# Altium schematic sheet CutMonitor.SchDoc
size 594 x 420 mm; DocumentNumber: ФНКЦ.452312.001 Э3; SheetNumber: 2; Format: A2
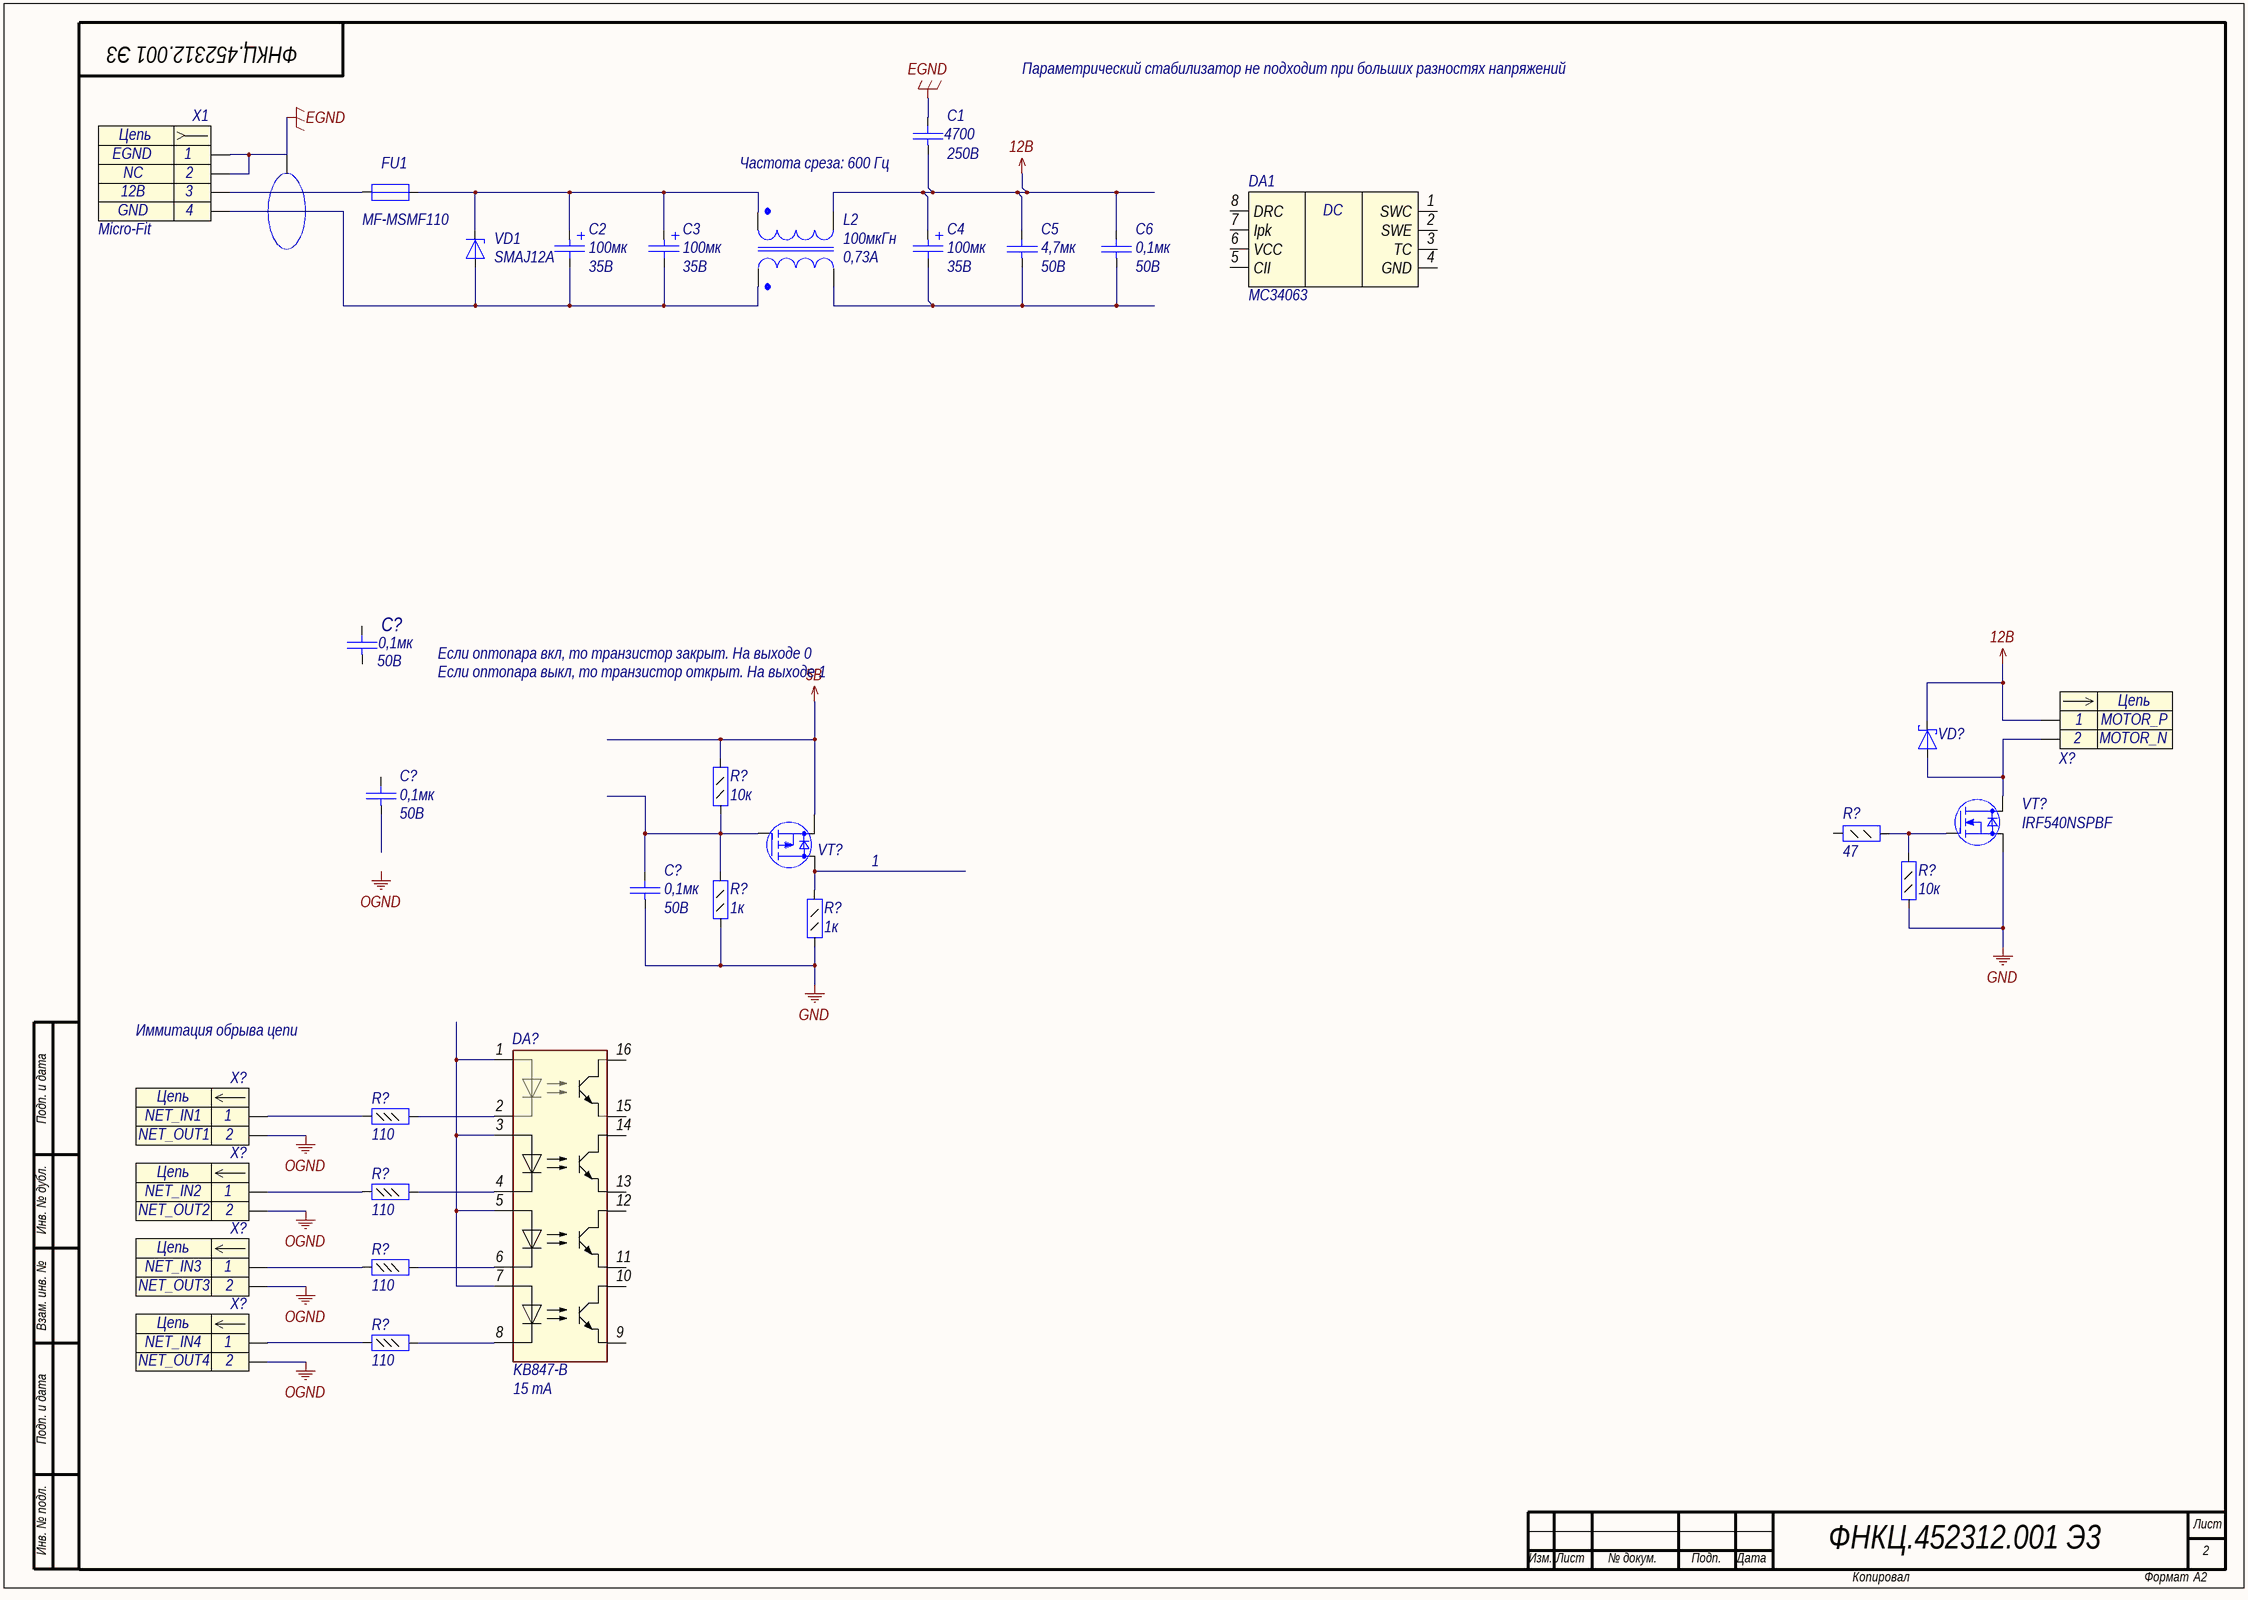
[diagram p0: CutMonitor.SchDoc]

## Parts
(Parts that share a designator on the sheet are numbered #1, #2 ... from top to bottom, then left to right.)
C1  value 4700  Voltage: 250В  [C0805]  (hidden comment: Capacitor)
C2  value 100мк  Voltage: 35В  [K50-35(6.3X11)]  (hidden comment: Capacitor_pol)
C3  value 100мк  Voltage: 35В  [K50-35(6.3X11)]  (hidden comment: Capacitor_pol)
C4  value 100мк  Voltage: 35В  [K50-35(6.3X11)]  (hidden comment: Capacitor_pol)
C5  value 4,7мк  Voltage: 50В  [C0805]  (hidden comment: Capacitor)
C6  value 0,1мк  Voltage: 50B  [C0603]  (hidden comment: Capacitor)
C?#1  value 0,1мк  Voltage: 50B  [C0603]  (hidden comment: Capacitor)
C?#2  value 0,1мк  Voltage: 50B  [C0805]  (hidden comment: Capacitor)
C?#3  value 0,1мк  Voltage: 50B  [C0805]  (hidden comment: Capacitor)
DA1  MC34063  [SO8]
DA?  Part Number: KB847-B  [OPTO-16]  (hidden comment: OPTO-4)
FU1  Part Number: MF-MSMF110  [FUSE812]  (hidden comment: Fuse)
L2  value 100мкГн  Rated Current: 0,73A  [SRF0703]  (hidden comment: Dual-Winding Inductor)
R?#1  value 10к  [R0805]  (hidden comment: Resistor_0,125Вт)
R?#2  value 47  [R0805]  (hidden comment: Resistor_0,125Вт)
R?#3  value 10к  [R0805]  (hidden comment: Resistor_0,125Вт)
R?#4  value 1к  [R0805]  (hidden comment: Resistor_0,125Вт)
R?#5  value 1к  [R0805]  (hidden comment: Resistor_0,125Вт)
R?#6  value 110  [R0603]  (hidden comment: Resistor_0,062Вт)
R?#7  value 110  [R0603]  (hidden comment: Resistor_0,062Вт)
R?#8  value 110  [R0603]  (hidden comment: Resistor_0,062Вт)
R?#9  value 110  [R0603]  (hidden comment: Resistor_0,062Вт)
VD1  Part Number: SMAJ12A  [SMA]  (hidden comment: DiodeZener)
VD?  DiodeSchottky  [SMA]  (value not drawn)
VT?#1  P-MOSFET  [SOT23-3]  (value not drawn)
VT?#2  Part Number: IRF540NSPBF  [D2PAK]  (hidden comment: N-MOSFET)
X1  Micro-Fit  [43045-0400]
X?#1  (no value)  [JUMPER_2.54]
X?#2  (no value)  [JUMPER_2.54]
X?#3  (no value)  [JUMPER_2.54]
X?#4  (no value)  [JUMPER_2.54]
X?#5  (no value)  [JUMPER_2.54]

## Nets
5В: R?#1.2 VT?#1.3(S)
12B: C1.1 C4.1 C5.2 C6.2 L2.4 VD?.1(K) X?#1.1
EGND: C1.2 X1.1 X1.2
GND: C?#3.1 R?#3.1 R?#4.1 R?#5.1 VT?#2.3(S)
OGND: X?#2.2 X?#3.2 X?#4.2 X?#5.2
NetC2_1: C2.1 C3.1 FU1.2 L2.2 VD1.1(K)
NetC2_2: C2.2 C3.2 L2.1 VD1.2(A) X1.4
NetC4_2: C4.2 C5.1 C6.1 L2.3
NetC?#3_2: C?#3.2 R?#1.1 R?#4.2 VT?#1.1(G)
NetDA?_1: DA?.1 DA?.3 DA?.5 DA?.7
NetDA?_2: DA?.2 R?#6.2
NetDA?_4: DA?.4 R?#7.2
NetDA?_6: DA?.6 R?#8.2
NetDA?_8: DA?.8 R?#9.2
NetFU1_1: FU1.1 X1.3
NetR?#2_2: R?#2.2 R?#3.2 VT?#2.1(G)
NetR?#5_2: R?#5.2 VT?#1.2(D)
NetR?#6_1: R?#6.1 X?#2.1
NetR?#7_1: R?#7.1 X?#3.1
NetR?#8_1: R?#8.1 X?#4.1
NetR?#9_1: R?#9.1 X?#5.1
NetVD?_2: VD?.2(A) VT?#2.2(D) X?#1.2

Not connected (* = marked no-connect by the designer): C?#1 1 2; C?#2 1 2; DA1 1(SWC) 2(SWE) 3(TC) 4(GND) 5(CII) 6(VCC) 7(Ipk) 8(DRC); DA? 9 10 11 12 13 14 15 16; R?#2 1

## Notes on the sheet
- Параметрический стабилизатор не подходит при больших разностях напряжений
- (near C1) Частота среза: 600 Гц
- Если оптопара вкл, то транзистор закрыт. На выходе 0
- Если оптопара выкл, то транзистор открыт. На выходе 1
- 1
- Иммитация обрыва цепи
- Подп. и дата
- Инв. № дубл.
- Взам. инв. №
- (near DA?) 15 mA
- Инв. № подл.
- Лист
- Изм.
- № докум.
- Подп.
- Дата
- Копировал
- Формат
- Labels drawn without touching a wire or pin: OGND
- (in symbol connect51) Цепь
- (in symbol connect54) Цепь
- (in symbol pwr21) DC

## Library data of the parts
C1 = cap170: Конденсатор; Part Name: Ceramic; Manufacture: Murata; Part Number: GRM21AR72E472KW; id: cap170; TKE: X7R
C2-C4 = cap226: Конденсатор полярный; Part Name: Electrolit; Manufacture: Jamicon; Part Number: TKR101M1VE11; id: cap226; tga: 0,20%
C5 = cap223: Конденсатор; Part Name: Ceramic; Manufacture: Murata; Part Number: GRM21BZ71H475KE15L; id: cap223; TKE: X7R
C6 C?#1 = cap131: Конденсатор; Part Name: Ceramic; Manufacture: Murata; Part Number: GRM188R71H104KA93D; id: cap131; TKE: X7R
C?#2 C?#3 = cap141: Конденсатор; Part Name: Ceramic; Manufacture: Murata; Part Number: GRM21BR71H104K**; id: cap141; TKE: X7R
DA1 = pwr21: 1.5 A, Step-Up/Down/  Inverting Switching  Regulators; Part Number: MC34063ADR2G; Manufacturer: ON Semiconductor; id: pwr21; Input Voltage: 3-40B; Output Voltage: Adj; Current: 1,5A; Part Name: 1.5 A, Step-Up/Down/ Inverting Switching Regulators; Type: Impulse
DA? = KB847-B: Опторазвязка х4; Manufacturer: Kingbright; id: opto1; Cut-off frequency: 80kHz; Forward Voltage: 1,2B
FU1 = fuse9: Предохранитель; Part Name: Resettable Fuses; Manufacture: Bourns; id: fuse9; V max: 6B; I max: 100A; I hold: 1,1A; I trip: 2,2A; Resistance: 0,04Ohms
L2 = ind24: Синфазный дроссель; Part Name: Dual-Winding Shielded Power Inductors; Part Number: SRF0703-101M; Manufacture: Bourns; id: ind24; Saturation Current: 0,79A; Resistance: 0,715Ohm
R?#1 R?#3 = res97: Резистор; Manufacture: Yageo; Part Number: RC0805FR-0710KL; id: res97; Accuracy: 0,01; Part Name: Resistor; Power: 0,125Вт
R?#2 = res41: Резистор; Manufacture: Yageo; Part Number: RC0805FR-0747RL; id: res41; Accuracy: 0,01; Part Name: Resistor; Power: 0,125Вт
R?#4 R?#5 = res73: Резистор; Manufacture: Yageo; Part Number: RC0805FR-071KL; id: res73; Accuracy: 0,01; Part Name: Resistor; Power: 0,125Вт
R?#6-R?#9 = res436: Резистор; Manufacture: Yageo; Part Number: RC0603FR-07110RL; id: res436; Accuracy: 0,01; Part Name: Resistor; Power: 0,062Вт
VD1 = SMAJ12A: Cтабилитрон (лавинный выпрямительный диод) односторонний; Part Name: TVS diode Unidirectional; Manufacture: ST Microelectronics; id: tvs128; Leakage Current: 0,2uA; Stand-off Voltage: 12B; Breakdown Voltage: 14B; Clamping voltage: 19,9B; Dynamic resistance: 0,259Ohm; Peak Pulse Power: 400W; Number of diodes: 1
VD? = diode2: Диод Шоттки; Part Number: SS14-E3/61T; Manufacture: Vishay; id: diode2; Max Reverse Voltage: 40B; Forward Voltage: 0,5В; Forward Current: 1A; Part Name: Diode Schottky
VT?#1 = trans5: N-MOSFET; Part Number: IRLML2244TRPbF; Manufacturer: International Rectifier; id: trans5; Structure: p-channel; V drain-source max: (-20B); Rds: 0,054Ohm; Gate-to-source voltage: (+-)12B; Continuous drain current: (-4,3)A; Pulsed drain current: (-18)A; Power dissipation: 1,3W
VT?#2 = trans7: Manufacturer: International Rectifier; id: trans7; Structure: n-channel; V drain-source max: 100B; Rds: 0,044Ohm; Gate-to-source voltage: (+-)20B; Continuous drain current: 33A; Pulsed drain current: 110A; Power dissipation: 130W
X1 = connect51: Разъем - 4 конт. розетка; Part Name: Micro-Fit 3.0 Right-Angle Header, 3.00mm Pitch; Manufacture: Molex; Contact_1: EGND; Contact_2: NC; Contact_3: 12В; Contact_4: GND; id: connect51; Part Number: 43045-0400
X?#1 = connect54: Разъем - 2 конт. вилка; Part Name: Jumper 2,54mm; Contact_1: MOTOR_P; Contact_2: MOTOR_N; Etch: 2,54mm; id: connect54
X?#2 = connect54: Разъем - 2 конт. вилка; Part Name: Jumper 2,54mm; Contact_1: NET_IN1; Contact_2: NET_OUT1; Etch: 2,54mm; id: connect54
X?#3 = connect54: Разъем - 2 конт. вилка; Part Name: Jumper 2,54mm; Contact_1: NET_IN2; Contact_2: NET_OUT2; Etch: 2,54mm; id: connect54
X?#4 = connect54: Разъем - 2 конт. вилка; Part Name: Jumper 2,54mm; Contact_1: NET_IN3; Contact_2: NET_OUT3; Etch: 2,54mm; id: connect54
X?#5 = connect54: Разъем - 2 конт. вилка; Part Name: Jumper 2,54mm; Contact_1: NET_IN4; Contact_2: NET_OUT4; Etch: 2,54mm; id: connect54